# EAGLE design smd_board_double_layer (EAGLE 6.6.0)
CNAME: 3Dator Extensionboard (C) 3Dator GmbH; CREVISION: 0.6; DESIGNER: 3Dator GmbH
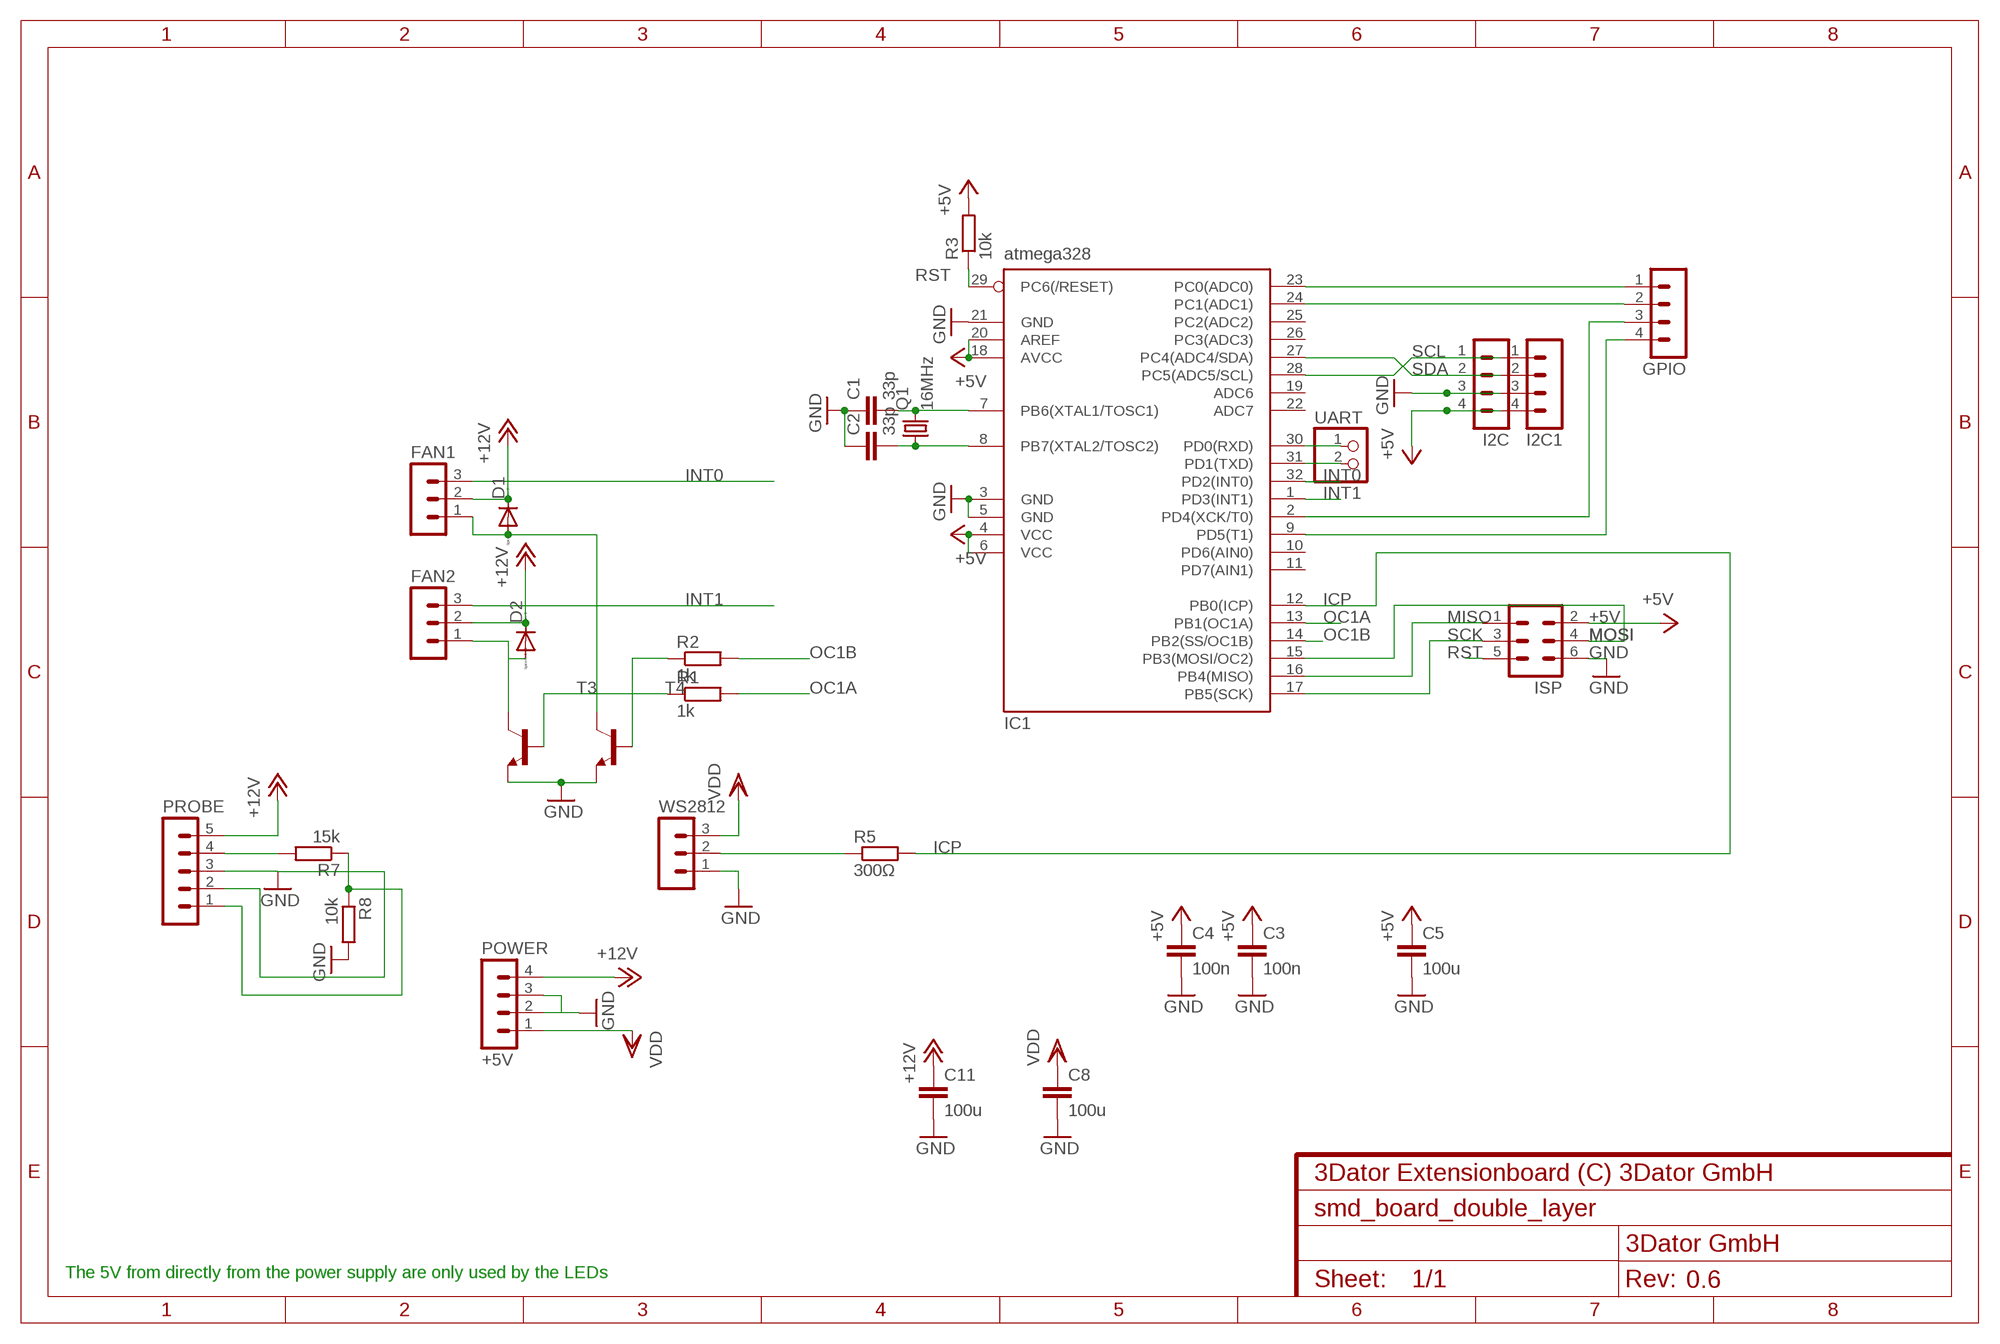
[diagram p0: schematic, sheet 1]

## Parts
C1  33p  C-EUC1206  [C1206]
C2  33p  C-EUC1206  [C1206]
C3  100n  C-EUC1206  [C1206]
C4  100n  C-EUC1206  [C1206]
C5  100u  C-EUC1206  [C1206]
C8  100u  C-EUC1206  [C1206]
C11  100u  C-EUC1206  [C1206]
D1  DIODE-SOD80C  [SOD80C]
D2  DIODE-SOD80C  [SOD80C]
FAN1  MA03-1  [MA03-1]
FAN2  MA03-1  [MA03-1]
GPIO  MA04-1  [MA04-1]
I2C  MA04-1  [MA04-1]
I2C1  MA04-1  [MA04-1]
IC1  atmega328  MEGA8-AI  [TQFP32-08]
ISP  MA03-2  [MA03-2]
POWER  +5V  MA04-1  [MA04-1]
PROBE  MA05-1  [MA05-1]
Q1  16MHz  CRYSTALHC49UP  [HC49UP]
R1  1k  R-EU_M1206  [M1206]
R2  1k  R-EU_R1206  [R1206]
R3  10k  R-EU_M1206  [M1206]
R5  300Ω  R-EU_R1206  [R1206]
R7  15k  R-EU_M1206  [M1206]
R8  10k  R-EU_M1206  [M1206]
T3  BC808-NPN-SOT23-BEC  [SOT23-BEC]
T4  BC808-NPN-SOT23-BEC  [SOT23-BEC]
UART  PINHD-1X2  [1X02]
WS2812  MA03-1  [MA03-1]

## Nets
+5V: C3.1 C4.1 C5.1 I2C1.4 I2C.4 IC1.4(VCC) IC1.6(VCC) IC1.18(AVCC) IC1.20(AREF) ISP.2 R3.2
+12V: C11.1 D1.C D2.C FAN1.2 FAN2.2 POWER.4 PROBE.5
GND: C1.1 C2.1 C3.2 C4.2 C5.2 C8.2 C11.2 I2C1.3 I2C.3 IC1.3(GND) IC1.5(GND) IC1.21(GND) ISP.6 POWER.2 POWER.3 PROBE.2 PROBE.3 R8.2 T3.E T4.E WS2812.1
ICP: IC1.12(PB0(ICP)) R5.2
INT0: FAN1.3 IC1.32(PD2(INT0))
INT1: FAN2.3 IC1.1(PD3(INT1))
MISO: IC1.16(PB4(MISO)) ISP.1
MOSI: IC1.15(PB3(MOSI/OC2)) ISP.4
N$2: C1.2 IC1.7(PB6(XTAL1/TOSC1)) Q1.2
N$3: D2.A FAN2.1 T3.C
N$4: D1.A FAN1.1 T4.C
N$5: R2.1 T4.B
N$6: R1.1 T3.B
N$7: R5.1 WS2812.2
N$9: C2.2 IC1.8(PB7(XTAL2/TOSC2)) Q1.1
N$13: IC1.30(PD0(RXD)) UART.1
N$14: PROBE.4 R7.2
N$15: GPIO.1 IC1.23(PC0(ADC0))
N$16: GPIO.2 IC1.24(PC1(ADC1))
N$17: IC1.31(PD1(TXD)) UART.2
N$20: GPIO.4 IC1.9(PD5(T1))
N$21: PROBE.1 R7.1 R8.1
N$22: GPIO.3 IC1.2(PD4(XCK/T0))
OC1A: IC1.13(PB1(OC1A)) R1.2
OC1B: IC1.14(PB2(SS/OC1B)) R2.2
RST: IC1.29(PC6(/RESET)) ISP.5 R3.1
SCK: IC1.17(PB5(SCK)) ISP.3
SCL: I2C1.1 I2C.1 IC1.28(PC5(ADC5/SCL))
SDA: I2C1.2 I2C.2 IC1.27(PC4(ADC4/SDA))
VDD: C8.1 POWER.1 WS2812.3
Unconnected: IC1.10(PD6(AIN0)) IC1.11(PD7(AIN1)) IC1.19(ADC6) IC1.22(ADC7) IC1.25(PC2(ADC2)) IC1.26(PC3(ADC3))

## Notes on the sheet
- The 5V from directly from the power supply are only used by the LEDs

## Library data of the parts
C1-C5 C8 C11 = rcl:C-EU: CAPACITOR, European symbol
D1 D2 = diode:DIODE-: DIODE
FAN1 FAN2 WS2812 = con-lstb:MA03-1: PIN HEADER; OC_FARNELL: unknown; OC_NEWARK: unknown
GPIO I2C I2C1 POWER = con-lstb:MA04-1: PIN HEADER; OC_FARNELL: unknown; OC_NEWARK: unknown
IC1 = atmel:MEGA8: MICROCONTROLLER 8 Kbytes FLASH, 1 kbytes SRAM, 512 bytes EEPROM, USART, 6-channel 10 bit ADC, 2-channel 8 bit ADC Pin compatible with Atmega48, ATMega88, ATMega168 Source: avr.lbr; MPN: ATMEGA8-16AU; OC_FARNELL: 9171371; OC_NEWARK: 73M8863
ISP = con-lstb:MA03-2: PIN HEADER; OC_FARNELL: unknown; OC_NEWARK: unknown
PROBE = con-lstb:MA05-1: PIN HEADER; OC_FARNELL: unknown; OC_NEWARK: unknown
Q1 = crystal:CRYSTAL: CRYSTAL; OC_FARNELL: unknown; OC_NEWARK: unknown
R1-R3 R5 R7 R8 = rcl:R-EU_: RESISTOR, European symbol
T3 T4 = transistor:*-NPN-: NPN Transistror BF959 corrected 2008.03.06
UART = pinhead:PINHD-1X2: PIN HEADER

## Net classes
0 default: clearance 0.205 mm

## Board
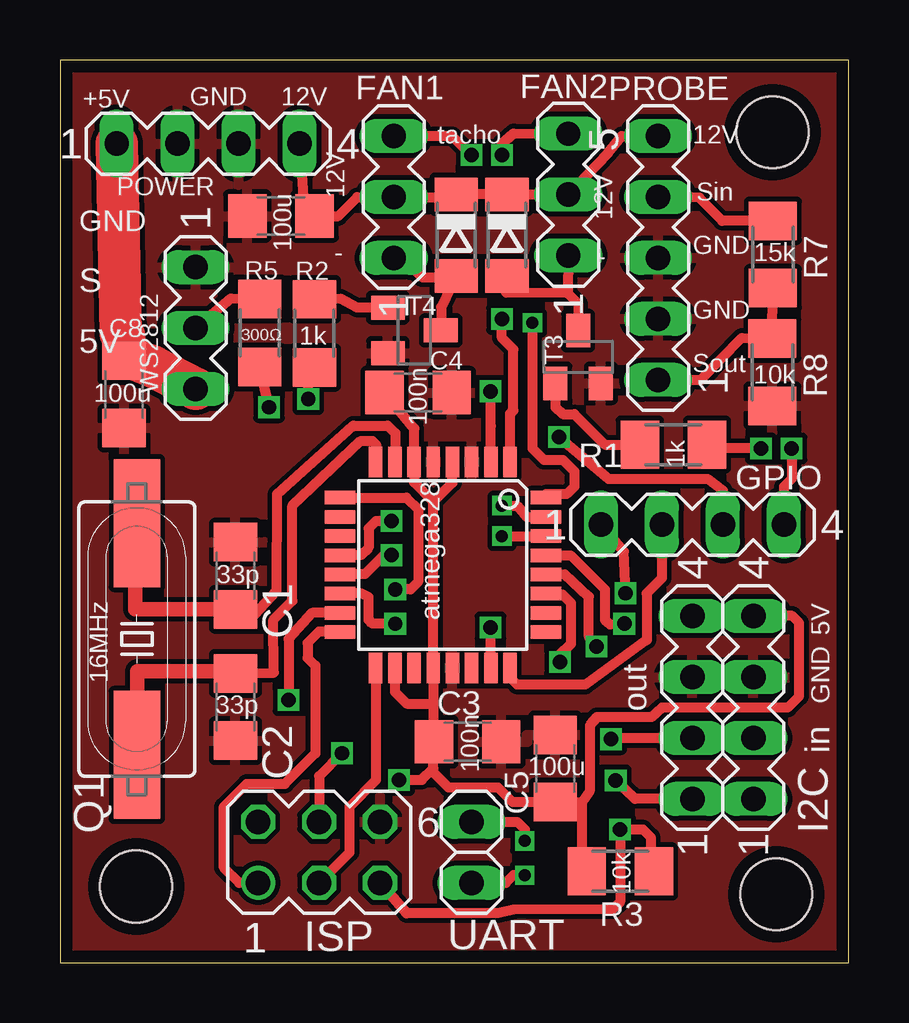
[diagram p1: board, top side]
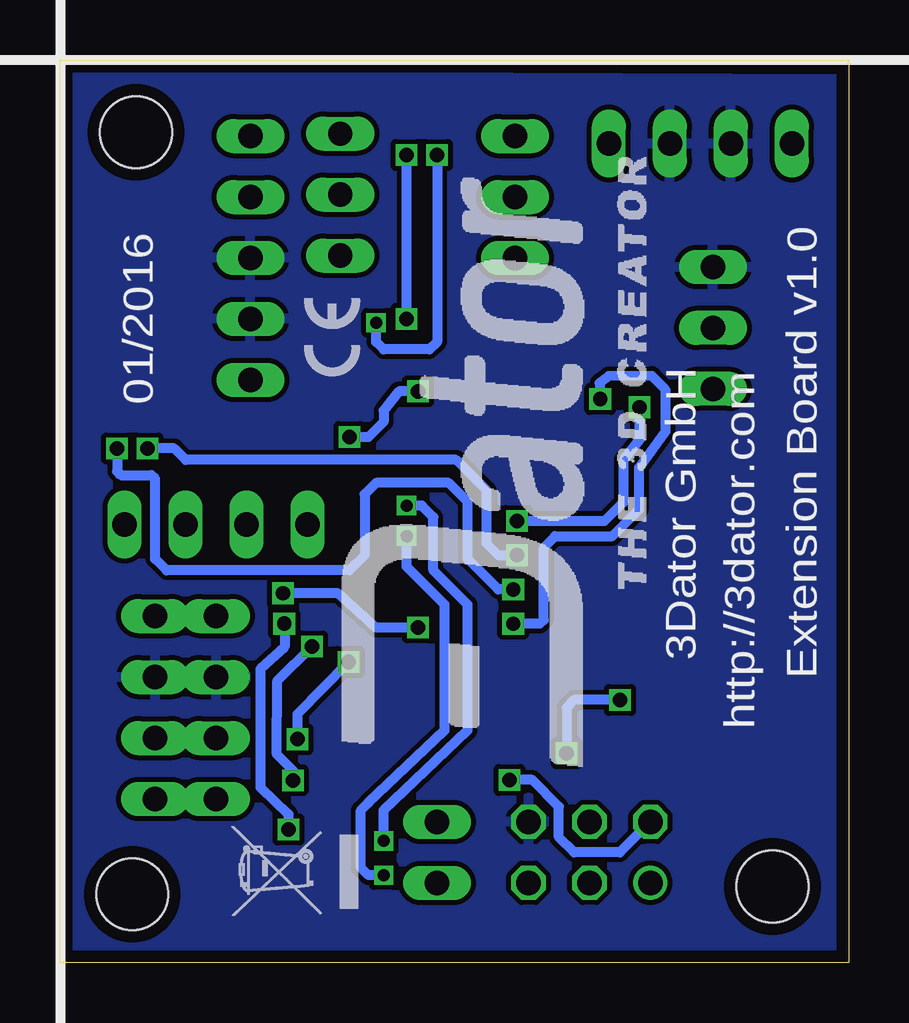
[diagram p2: board, bottom side, seen from below]

Size 32.86 x 37.62 mm. Coordinates in mm from the lower left corner, seen from the top.
Outline: 0,0 32.86,0 32.86,37.62 0,37.62 0,0
Copper layers (1*16): Top 0.035mm / dielectric 1.5mm / Bottom 0.035mm
Design rules "maybepcbpool": minimum track width 6mil, minimum drill 12mil, track to track 6mil, track to pad 6mil, pad to pad 6mil, via to via 6mil, smd to smd 6mil, copper to edge 20mil, drill to drill 8mil, minimum pad ring 8mil, minimum via ring 6mil, stop-mask expansion 3mil, vias tented up to drill 0mil, thermal gap 8mil
Holes 3 mm at 29.85,2.86 29.69,34.61 3.17,3.17
vRestrict: area -7.1,-16.5 to -5.6,-15.9; area 31.4,-16.5 to 32.9,-15.9; area 10.1,-15.8 to 15.6,-14; area -11.9,-12.4 to -11.3,-10.9; area -11.9,36.1 to -11.3,37.6; area -13.8,9.8 to -12,15.4; 6 lines

### Footprints (pad centres in the part's own frame; a part is rotated, then mirrored left to right if it is on the bottom)
C1206 = smd 1.6 x 1.8: 1 -1.4,0; 2 1.4,0
SOD80C = smd 1.4 x 1.8: A 1.7,0; C -1.7,0
MA03-1 = drill 1.016 long: 1 -2.54,0; 2 0,0; 3 2.54,0
MA04-1 = drill 1.016 long: 1 -3.81,0; 2 -1.27,0; 3 1.27,0; 4 3.81,0
TQFP32-08 = smd 1.27 x 0.559: 1 -4.293,2.8; 2 -4.293,2; 3 -4.293,1.2; 4 -4.293,0.4; 5 -4.293,-0.4; 6 -4.293,-1.2; 7 -4.293,-2; 8 -4.293,-2.8; 17 4.293,-2.8; 18 4.293,-2; 19 4.293,-1.2; 20 4.293,-0.4; 21 4.293,0.4; 22 4.293,1.2; 23 4.293,2; 24 4.293,2.8 | smd 0.559 x 1.27: 9 -2.8,-4.293; 10 -2,-4.293; 11 -1.2,-4.293; 12 -0.4,-4.293; 13 0.4,-4.293; 14 1.2,-4.293; 15 2,-4.293; 16 2.8,-4.293; 25 2.8,4.293; 26 2,4.293; 27 1.2,4.293; 28 0.4,4.293; 29 -0.4,4.293; 30 -1.2,4.293; 31 -2,4.293; 32 -2.8,4.293
MA03-2 = drill 1.016: 1 -2.54,-1.27 | drill 1.016 octagon: 2 -2.54,1.27; 3 0,-1.27; 4 0,1.27; 5 2.54,-1.27; 6 2.54,1.27
MA05-1 = drill 1.016 long: 1 -5.08,0; 2 -2.54,0; 3 0,0; 4 2.54,0; 5 5.08,0
HC49UP = smd 5.334 x 1.93: 1 -4.826,0; 2 4.826,0
M1206 = smd 1.6 x 2: 1 -1.4,0; 2 1.4,0
R1206 = smd 1.6 x 1.803: 1 -1.422,0; 2 1.422,0
SOT23-BEC = smd 1 x 1.4: B -0.95,-1.1; C 0,1.1; E 0.95,-1.1
1X02 = drill 1.016 long: 1 -1.27,0; 2 1.27,0

### Placement (x,y rotation side)
C1  7.31,16.13 270 top
C2  7.31,10.66 90 top
C3  16.99,9.21 0 top
C4  14.92,23.76 0 top
C5  20.64,8.1 90 top
C8  2.67,23.68 270 top
C11  9.21,31.12 180 top
D1  16.51,30.32 270 top
D2  18.62,30.32 270 top
FAN1  13.9,31.91 90 top
FAN2  21.18,32.01 90 top
GPIO  26.35,18.26 0 top
I2C  26.35,10.64 90 top
I2C1  28.89,10.64 90 top
IC1  15.95,16.58 270 top
ISP  10.79,4.6 0 top
POWER  6.17,34.13 0 top
PROBE  24.92,29.37 90 top
Q1  3.2,13.49 90 top
R1  25.56,21.59 0 top
R2  10.6,26.23 270 top
R3  23.35,3.81 180 top
R5  8.33,26.24 270 top
R7  29.7,29.51 90 top
R8  29.69,24.61 270 top
T3  21.59,25.24 0 top
T4  14.76,26.35 270 top
UART  17.14,4.6 90 top
WS2812  5.65,26.45 270 top

### Tracks (layer width: path | path; a pad name or v marks a point on that pad's centre or on a via)
+5V  (via drill 0.6)
  Top 0.406: 15.56,12.45 IC1.20 | 16.35,21.03 IC1.4 16.35,21.03 | IC1.20 15.55,19.2 | 16.35,21.03 16.35,20 15.55,19.2 | C4.1 14.76,22.25 14.76,21.03 IC1.6 14.75,20.02 15.55,19.22 15.55,19.2 | 21.75,6.67 22.07,7.14 22.08,9.9 22.37,10.24 24.64,10.23 25.08,10.64 30.32,10.64 30.8,11.11 30.8,14.16 30.51,14.46 28.37,14.46 28.36,14.45 | 21.75,6.67 C5.1 18.86,6.7 18.26,7.3 16.19,7.3 15.56,7.94 15.56,8.1 | IC1.20 15.55,10.79 | 15.55,10.79 15.55,9.4 C3.1 15.56,9.18 15.56,8.1 | I2C1.4 28.36,14.45 | 28.36,14.45 I2C.4 | 21.75,6.67 21.75,4.01 R3.2 | v14.13,7.62 15.08,7.62 15.56,8.1 | IC1.18 13.95,11.29 14.45,10.79 15.55,10.79
  Bottom 0.406: ISP.2 9.53,4.6 11.43,4.6 12.07,5.24 12.07,6.51 13.18,7.62 v14.13,7.62
+12V
  Top 0.406: POWER.4 10.16,31.56 C11.1 11.59,31.12 12.38,31.91 FAN1.2 15.76,31.91 D1.C D2.C 20.68,32.02 FAN2.2 22.82,33.73 23.4,34.45 PROBE.5
GND
  pour Top: -0.16,0.16 -0.08,37.34 32.62,37.34 32.44,-0.14
  pour Bottom: 0.48,0.48 32.12,0.32 32.23,36.99 0.32,36.83
ICP  (via drill 0.6)
  Top 0.406: v8.71,23.15 R5.2 | v13.81,18.41 13.18,18.41 12.86,18.1 12.86,17.3 12.54,16.99 IC1.12
  Bottom 0.406: v8.71,23.15 8.71,21.79 9.37,20.95 9.37,19.21 10.16,18.41 v13.81,18.41
INT0  (via drill 0.5, 0.6)
  Top 0.406: v19.69,26.67 19.69,21.43 20.16,20.95 20.96,20.95 21.43,20.48 21.43,19.84 21.11,19.53 20.26,19.53 IC1.32 | v17.15,33.66 16.35,34.45 FAN1.3
  Bottom 0.406: v17.15,33.66 17.15,25.88 17.46,25.56 19.37,25.56 19.69,25.88 v19.69,26.67
INT1  (via drill 0.6)
  Top 0.406: IC1.1 18.75,22.88 18.89,23.02 18.89,25.56 18.42,26.03 v18.42,26.83 | v18.42,33.66 18.42,34.13 18.9,34.56 FAN2.3
  Bottom 0.406: v18.42,26.83 v18.42,33.66
MISO
  Top 0.406: ISP.1 7.46,3.33 6.83,3.97 6.83,6.51 7.78,7.46 9.37,7.46 10.64,8.73 10.64,12.38 10.32,12.7 10.32,13.34 10.8,13.81 11.63,13.81 IC1.16
MOSI  (via drill 0.6)
  Top 0.406: IC1.15 10.5,14.58 9.53,13.49 v9.53,10.95 | v11.75,8.73 10.8,7.78 ISP.4
  Bottom 0.406: v9.53,10.95 11.43,10.95 11.75,10.64 v11.75,8.73
N$2
  Top 0.406: 3.33,18.89 Q1.2 | C1.2 8.09,14.49 9.03,15.52 9.05,19.53 12.22,22.38 13.65,22.38 13.97,22.07 13.97,21.05 IC1.7
  Top 0.61: C1.2 3.14,14.73 3.18,19.53 3.18,19.05 3.33,18.89
N$3
  Top 0.406: D2.A 18.57,27.94 18.59,27.93 20.95,27.95 | 20.95,27.95 21.13,27.93 21.59,27.46 T3.C | FAN2.1 21.15,27.89 20.95,27.95
N$4
  Top 0.406: T4.C 15.88,27.32 D1.A 15.83,28.58 15.08,28.58 14.29,29.37 FAN1.1
N$5
  Top 0.406: T4.B 12.7,27.3 12.38,27.31 11.7,27.67 R2.1
N$6
  Top 0.406: T3.B 20.64,23.15 20.96,22.86 21.43,22.86 22.7,21.59 R1.1
N$7
  Top 0.406: WS2812.2 7.12,27.69 R5.1
N$9
  Top 0.406: IC1.8 13.18,21.06 13.18,21.59 13.02,21.75 12.54,21.75 9.68,19.05 9.68,15.08 8.89,14.29 8.91,12.09 C2.2 6.86,12.16
  Top 0.61: Q1.1 3.21,12.16 6.86,12.16
N$13  (via drill 0.5)
  Top 0.406: UART.1 18.57,3.33 18.89,3.65 v19.37,3.65 | v18.42,17.78 20.09,17.78 IC1.30
  Bottom 0.406: v19.37,3.65 20,3.65 20.32,3.97 20.32,6.35 20,6.67 16.83,9.68 16.83,14.92 18.42,16.51 v18.42,17.78
N$14
  Top 0.406: R7.2 27.59,30.92 26.64,31.88 PROBE.4
N$15  (via drill 0.6)
  Top 0.406: IC1.23 17.94,12.45 v17.94,13.97 | v23.57,15.4 23.5,17.14 GPIO.1
  Bottom 0.406: v17.94,13.97 19.69,13.97 21.27,15.4 v23.57,15.4
N$16
  Top 0.406: GPIO.2 25.08,16.03 24.45,15.4 24.46,13.46 21.88,11.59 19.05,11.59 18.73,11.91 18.73,12.43 IC1.24
N$17  (via drill 0.5)
  Top 0.406: UART.2 19.05,5.87 19.37,5.56 v19.37,5.08 | v18.42,19.05 19.05,19.05 19.46,18.57 IC1.31
  Bottom 0.406: v19.37,5.08 19.37,6.35 15.88,9.68 15.88,14.92 17.3,16.35 17.3,18.57 17.78,19.05 v18.42,19.05
N$20  (via drill 0.6)
  Top 0.406: IC1.9 14.43,19.38 14.92,18.89 14.92,15.88 14.61,15.56 v13.97,15.56 | v30.48,21.43 30.48,20.16 30.16,19.84 GPIO.4
  Bottom 0.406: v13.97,15.56 14.61,15.56 15.88,16.83 15.88,19.21 16.67,20 19.69,20 20.16,19.53 20.16,16.99 20.8,16.35 28.42,16.35 28.89,16.83 28.89,20.16 29.05,20.32 30.32,20.32 30.48,20.48 v30.48,21.43
N$21
  Top 0.406: PROBE.1 26.7,24.29 28.42,26.03 R8.1 R7.1
N$22  (via drill 0.6)
  Top 0.406: IC1.2 17.95,22.37 v17.94,23.81 | v20.8,21.91 22.86,20.16 26.99,20.16 27.62,19.69 GPIO.3
  Bottom 0.406: v17.94,23.81 18.73,23.81 19.37,23.02 19.37,22.54 20,21.91 v20.8,21.91
OC1A  (via drill 0.6)
  Top 0.406: v29.21,21.43 26.99,21.43 R1.2 | v13.81,16.99 13.49,16.99 12.7,16.19 11.67,16.19 IC1.13
  Bottom 0.406: v29.21,21.43 28.1,21.43 27.62,20.95 16.35,20.95 15.08,19.69 15.08,17.46 14.61,16.99 v13.81,16.99
OC1B  (via drill 0.6)
  Top 0.406: v10.35,23.5 10.32,24.95 R2.2 | v13.97,14.13 13.02,14.13 12.86,14.29 12.86,15.24 12.54,15.4 11.68,15.4 IC1.14
  Bottom 0.406: v13.97,14.13 12.86,14.13 12.7,14.29 12.7,17.3 12.22,17.78 9.84,17.78 8.73,18.89 8.73,20.64 7.62,22.14 7.62,23.87 8.2,24.46 10,24.45 10.37,24.16 v10.35,23.5
RST  (via drill 0.6)
  Top 0.406: IC1.29 21.28,16.98 22.7,15.56 22.7,14.29 22.92,14.1 v23.51,14.13 | R3.1 24.61,4.46 24.61,5.24 24.29,5.56 v23.34,5.56 23.34,2.54 23.02,2.22 18.9,2.21 18.25,2.07 14.45,2.06 ISP.5
  Bottom 0.406: v23.51,14.13 23.5,13.18 24.51,12.25 24.5,7.31 23.34,6.19 v23.34,5.56
SCK
  Top 0.406: ISP.3 12.07,4.6 12.07,6.51 13.18,7.62 13.18,12.26 IC1.17
SCL  (via drill 0.6)
  Top 0.406: I2C1.1 I2C.1 23.97,6.83 v23.15,7.6 | v22.35,13.19 22.03,13.59 22.03,15.26 21.04,16.19 IC1.28
  Bottom 0.406: v23.15,7.6 23.15,8.02 23.82,8.69 23.8,11.76 v22.35,13.19
SDA  (via drill 0.6)
  Top 0.406: I2C1.2 I2C.2 22.95,9.37 v22.96,9.32 | v20.83,12.54 20.83,12.83 21.3,13.29 21.3,14.99 20.94,15.35 20.28,15.35 IC1.27
  Bottom 0.406: v22.96,9.32 22.96,10.38 v20.83,12.54
VDD
  Top 1.27: C8.1 2.67,26.1
  Top 1.778: POWER.1 2.54,26.23 2.67,26.1 2.67,25.31 3.89,24.84 WS2812.3

### Text on the board
tNames: GND | 12V | tacho | 12V | 12V | Sin | GND | 12V | - | GND | - | S | GND | 5V | Sout | 5V | out | GND | in
bNames: Extension Board v1.0 | http://3dator.com | 01/2016 | 3Dator GmbH